# Altium project jetson-nano-baseboard.PrjPcb (part 2 of 2)
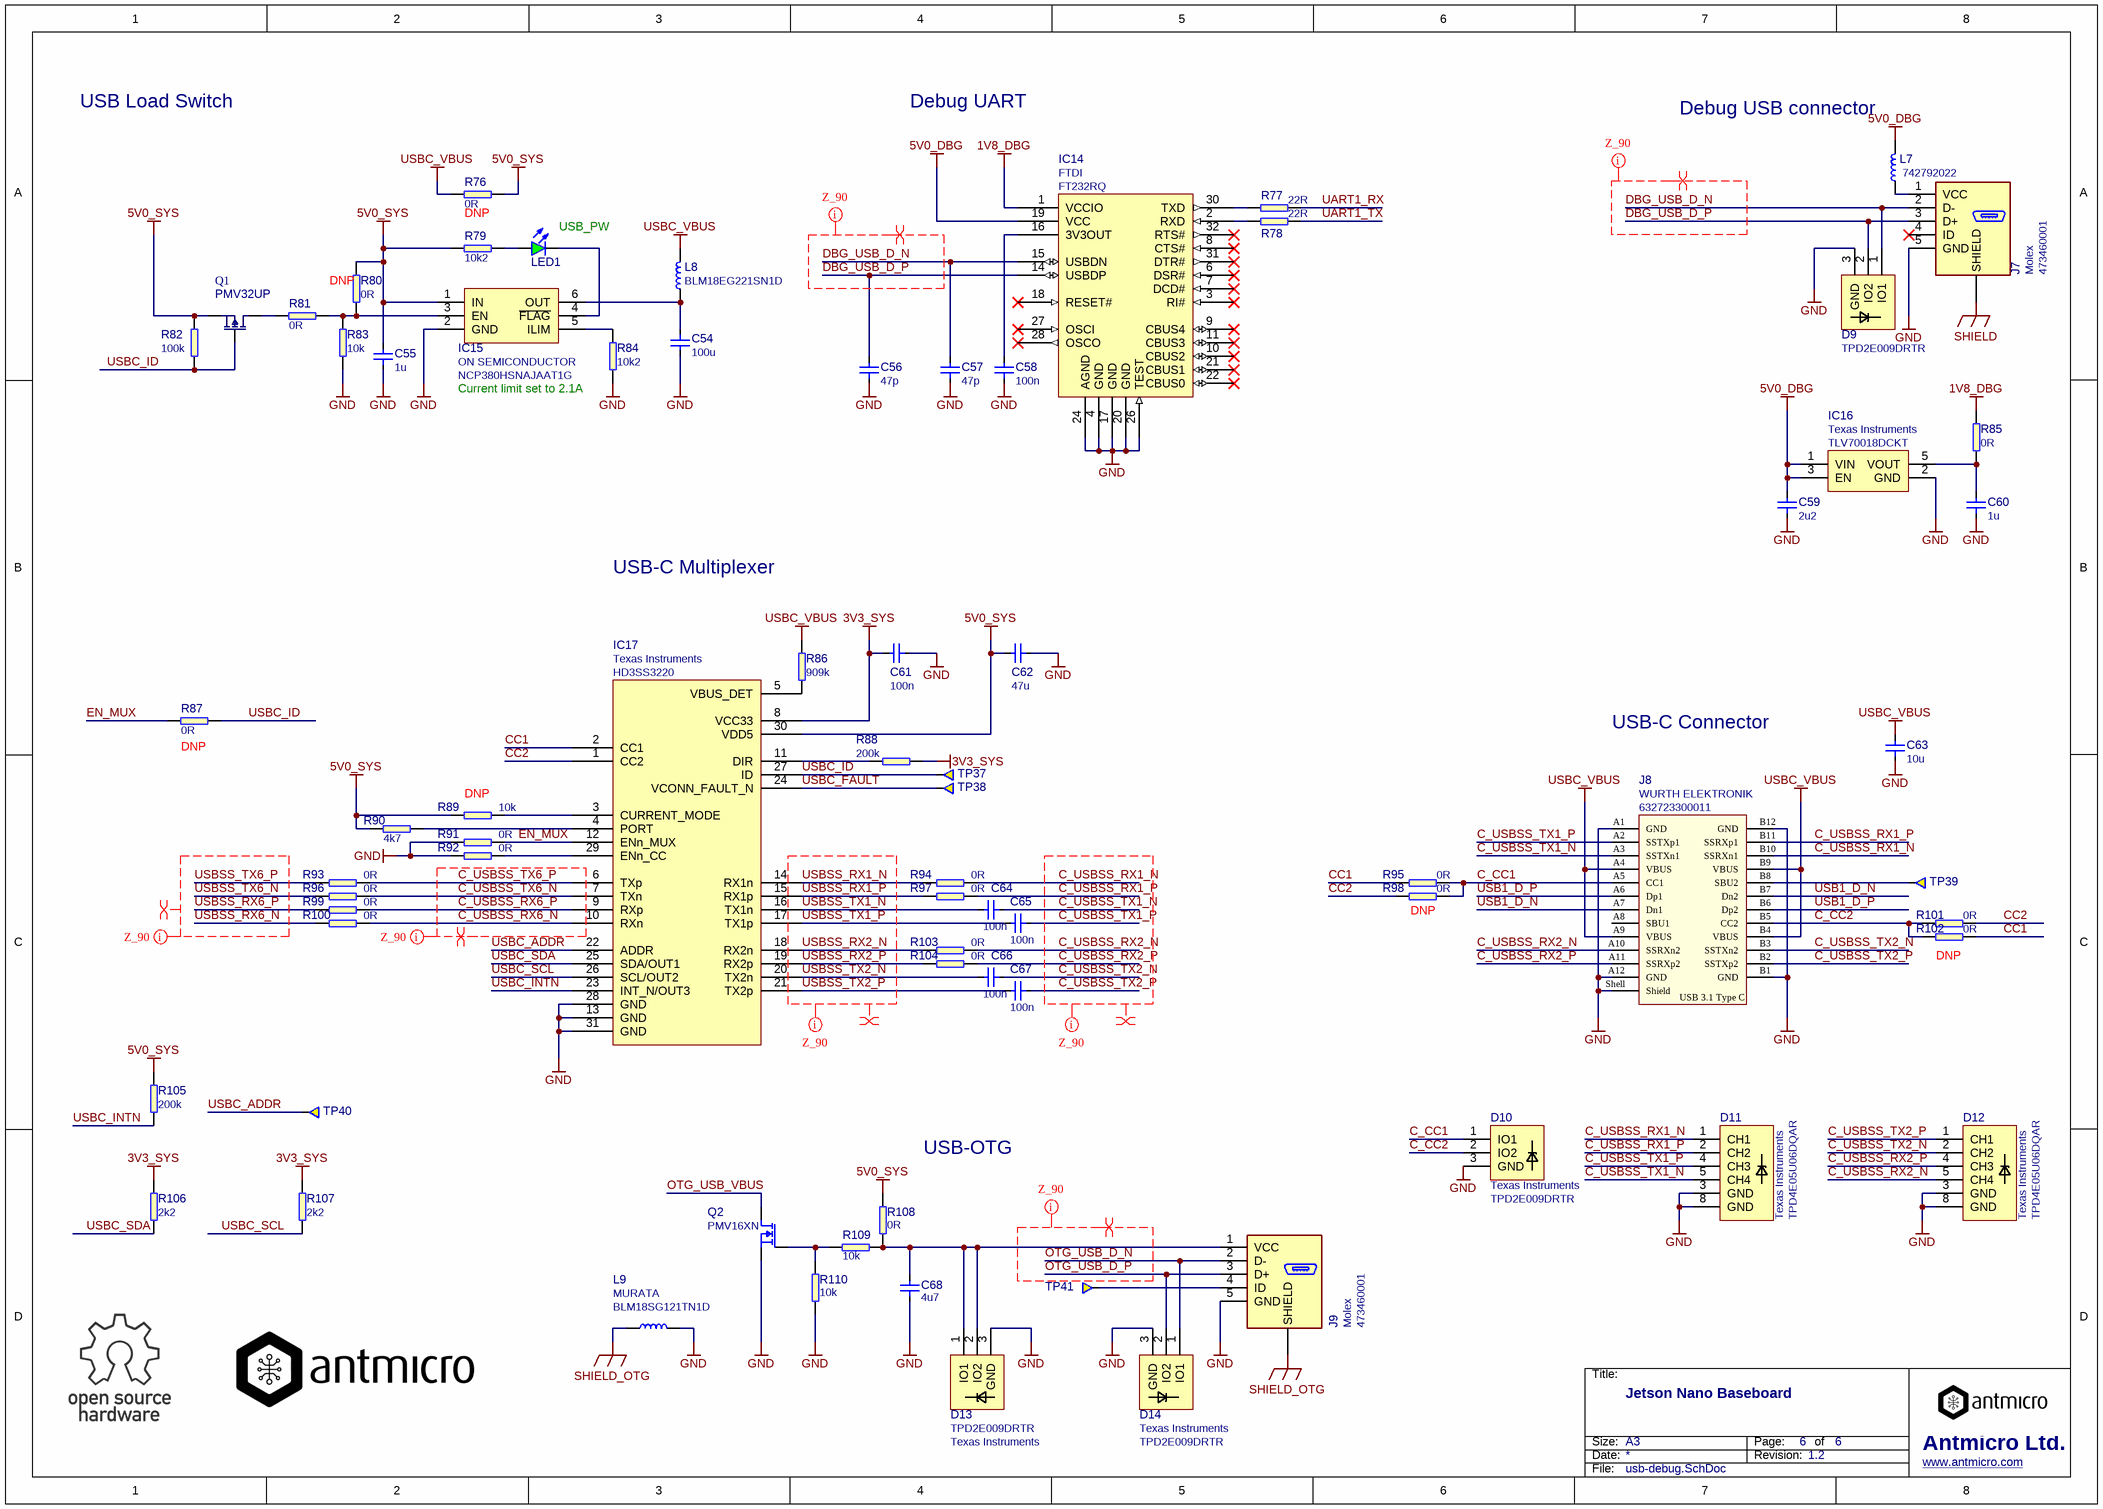
[diagram p6: usb-debug.SchDoc]

## Nets that join several sheets
1V8_SYS: csi (R1.2 R3.2), display (C28.2 IC4.5 R46.2), supply (C50.2 IC13.5 TP36.1)
3V3_FFC1: csi (J1.47 J1.48 R2.2), supply (C53.2 IC12.4 L6.2 TP35.1)
3V3_FFC2: csi (J2.47 J2.48 R4.2), supply (C49.2 IC11.4 L5.2 TP33.1)
3V3_SYS: csi (5 pins), display (5 pins), ethernet (R50.2 R51.1), supply (C45.2 IC7.6 TP31.1), usb-debug (5 pins)
5V0_SYS: csi (J1.49 J1.50 J2.49 J2.50), display (IC5.13 IC5.14 L2.1), SoM (F1.1 R52.2 R53.2), supply (24 pins), usb-debug (13 pins)
EGND: ethernet (C30.2 J5.S), SoM (SP4.1)
GND: csi (17 pins), display (41 pins), ethernet (C29.1 C30.1), SoM (86 pins), supply (43 pins), usb-debug (43 pins)
#SHUTDOWN_REQ: SoM (M1.233 TP18.1), supply (IC9.2)
ENET_LED0: ethernet (J5.14), SoM (M1.194)
ENET_LED1: ethernet (J5.12), SoM (M1.188)
ENET_TRD0_N: ethernet (J5.1), SoM (M1.184)
ENET_TRD0_P: ethernet (J5.2), SoM (M1.186)
ENET_TRD1_N: ethernet (J5.3), SoM (M1.190)
ENET_TRD1_P: ethernet (J5.4), SoM (M1.192)
ENET_TRD2_N: ethernet (J5.7), SoM (M1.196)
ENET_TRD2_P: ethernet (J5.8), SoM (M1.198)
ENET_TRD3_N: ethernet (J5.9), SoM (M1.202)
ENET_TRD3_P: ethernet (J5.10), SoM (M1.204)
OTG_USB_D_N: SoM (M1.109), usb-debug (D14.1 J9.2)
OTG_USB_D_P: SoM (M1.111), usb-debug (D14.2 J9.3)
OTG_USB_VBUS: display (M1.87), usb-debug (Q2.3)
PWR_EN: SoM (M1.237 TP17.1), supply (IC10.4 R75.2 T4.1)
PWR_GOOD: SoM (T3.1), supply (7 pins)
UART1_RX: SoM (M1.238), usb-debug (R77.2)
UART1_TX: SoM (M1.236), usb-debug (R78.2)
USB1_D_N: SoM (M1.115), usb-debug (J8.A7 J8.B7)
USB1_D_P: SoM (M1.117), usb-debug (J8.A6 J8.B6)
USBSS_RX6_N: SoM (M1.161), usb-debug (R100.1)
USBSS_RX6_P: SoM (M1.163), usb-debug (R99.1)
USBSS_TX6_N: SoM (M1.166), usb-debug (R96.1)
USBSS_TX6_P: SoM (M1.168), usb-debug (R93.1)

## Assembly variants
Prototype: not fitted C36 C37 C38 C46 C47 C49 C51 C52 R23 R37 R42 R47 R54 R56 R64 R66 R71 R75 R77 R79 R87 R89 R91